# Altium schematic sheet Quail.SchDoc: Top Sheet
size Tabloid; DocumentNumber: 1; SheetNumber: 1; SheetTotal: 8; Project: Olympus
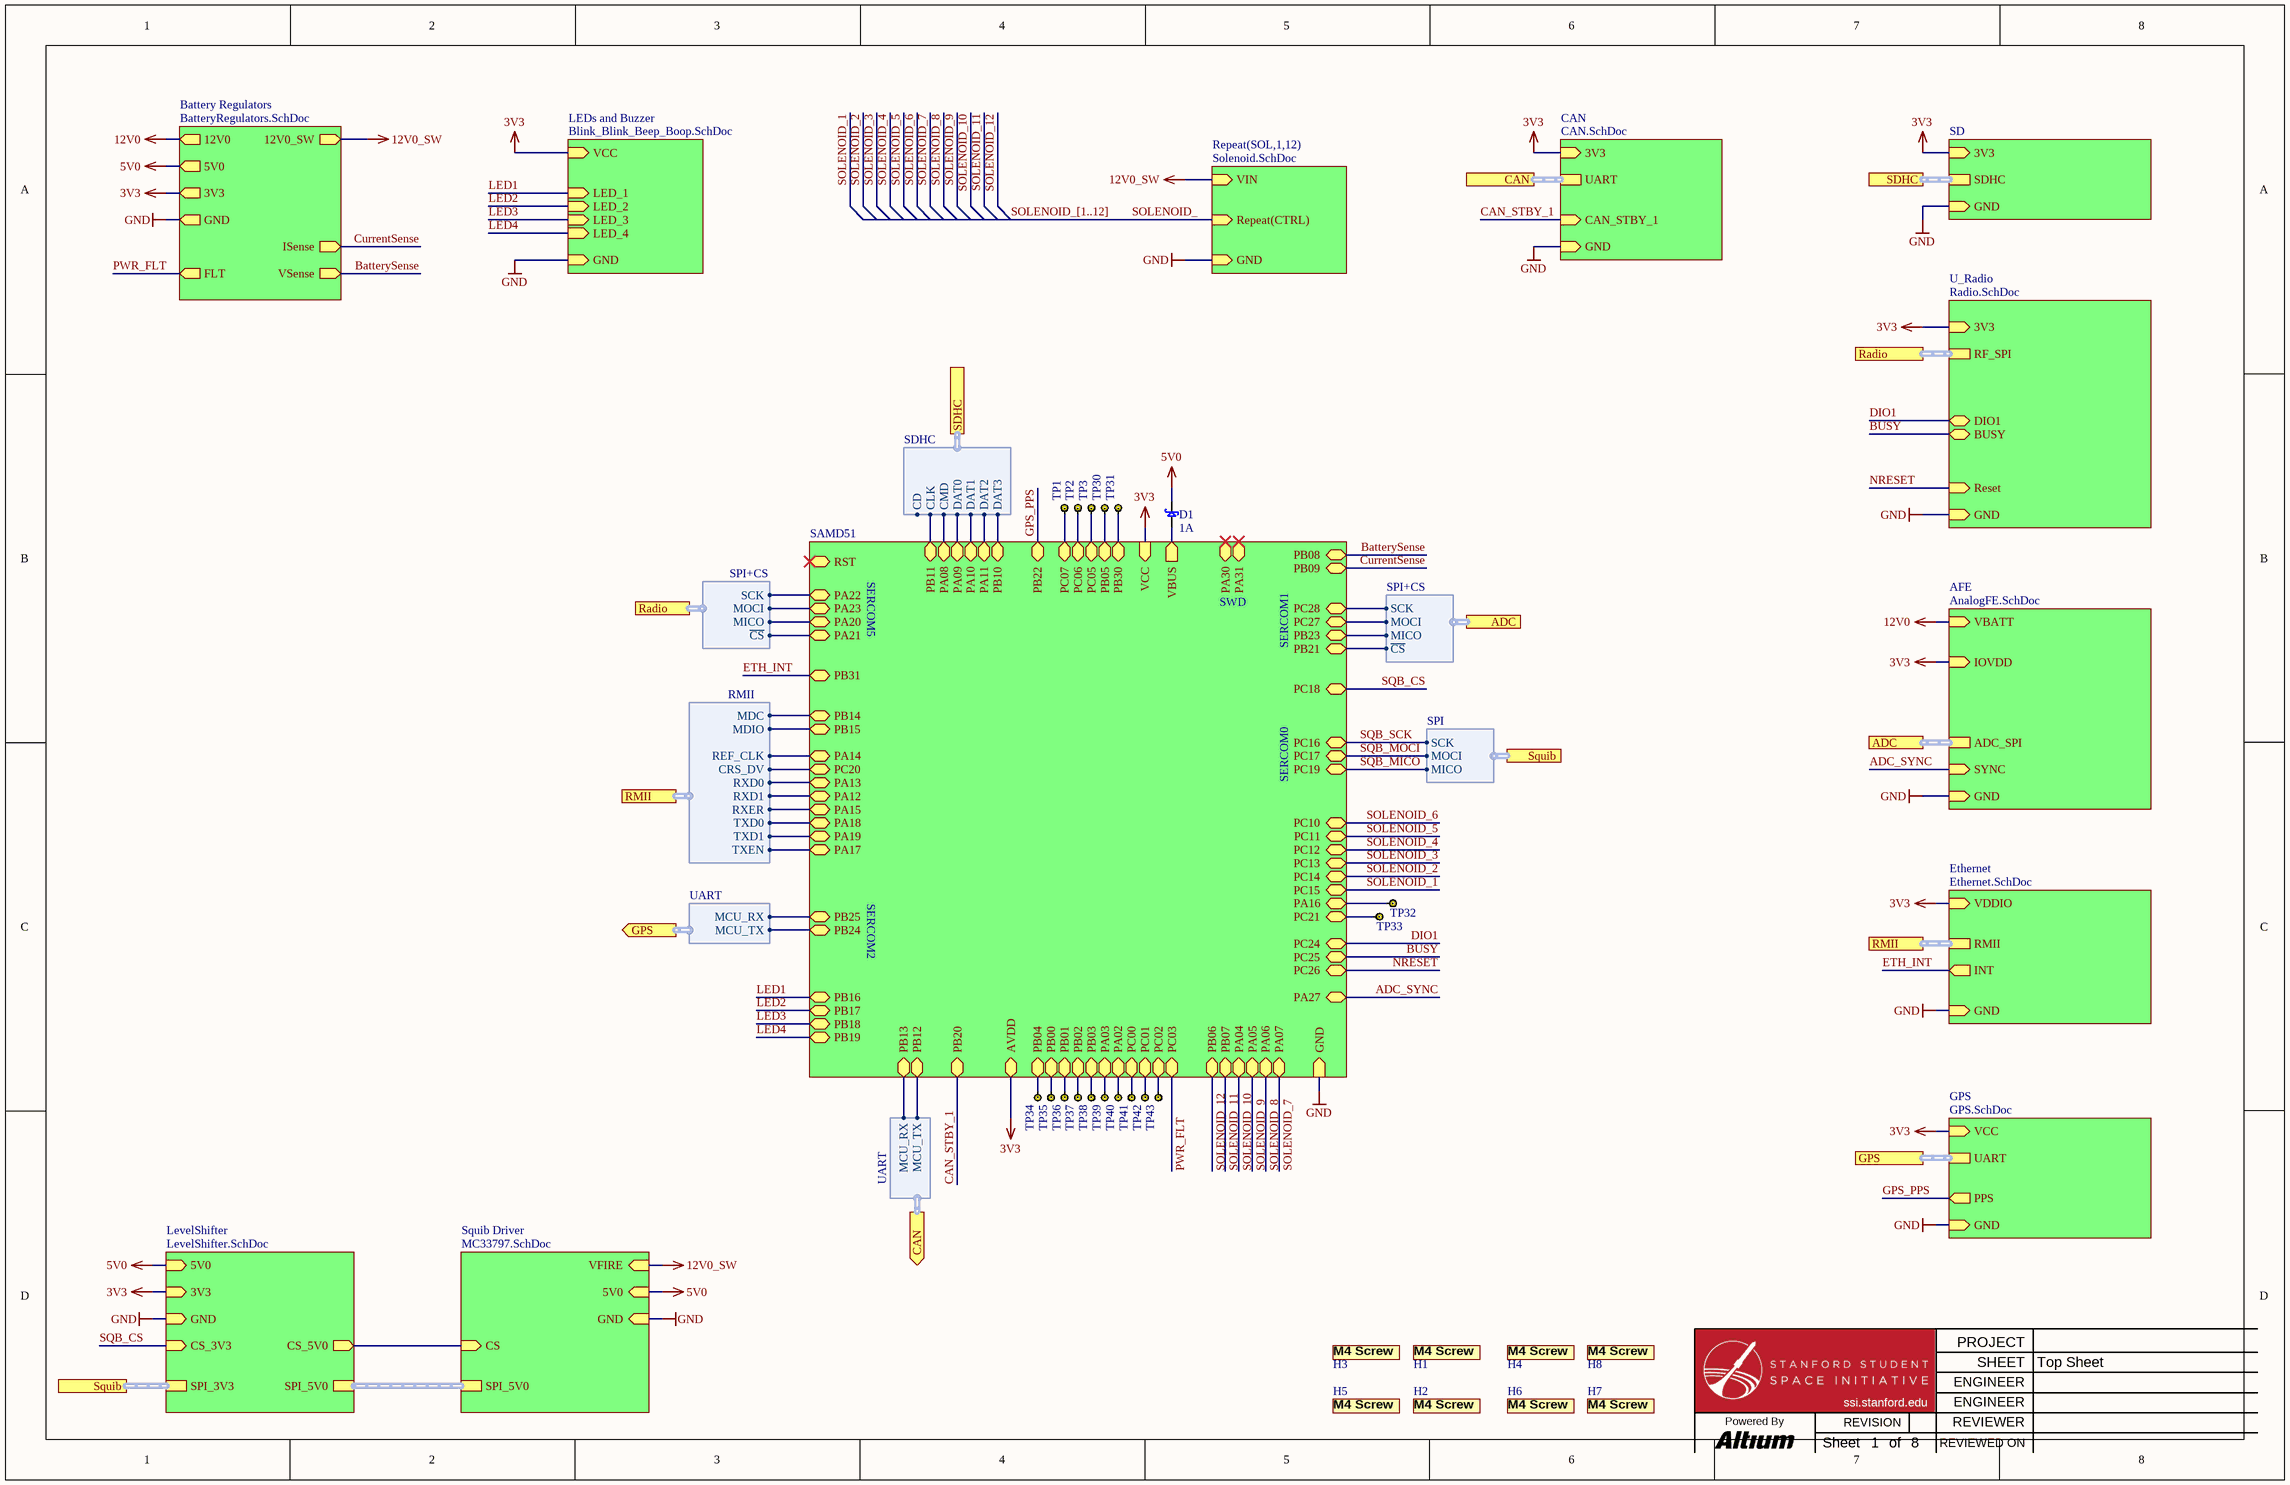
[diagram p0: Quail.SchDoc]

## Parts
D1  Current - Average Rectified (Io): 1A  [SMA]  (hidden comment: Diode_CD214A-B1100LF)
H1  SCREW_M4_PAN_PHILLIPS  [SCREW_M4]  (value not drawn)
H2  SCREW_M4_PAN_PHILLIPS  [SCREW_M4]  (value not drawn)
H3  SCREW_M4_PAN_PHILLIPS  [SCREW_M4]  (value not drawn)
H4  SCREW_M4_PAN_PHILLIPS  [SCREW_M4]  (value not drawn)
H5  SCREW_M4_PAN_PHILLIPS  [SCREW_M4]  (value not drawn)
H6  SCREW_M4_PAN_PHILLIPS  [SCREW_M4]  (value not drawn)
H7  SCREW_M4_PAN_PHILLIPS  [SCREW_M4]  (value not drawn)
H8  SCREW_M4_PAN_PHILLIPS  [SCREW_M4]  (value not drawn)
TP1  TEST_POINT_BLACK_KEYSTONE_5001  [TEST_POINT_BLACK_KEYSTONE_5001-Footprint-1]  (value not drawn)
TP2  TEST_POINT_BLACK_KEYSTONE_5001  [TEST_POINT_BLACK_KEYSTONE_5001-Footprint-1]  (value not drawn)
TP3  TEST_POINT_BLACK_KEYSTONE_5001  [TEST_POINT_BLACK_KEYSTONE_5001-Footprint-1]  (value not drawn)
TP30  TEST_POINT_BLACK_KEYSTONE_5001  [TEST_POINT_BLACK_KEYSTONE_5001-Footprint-1]  (value not drawn)
TP31  TEST_POINT_BLACK_KEYSTONE_5001  [TEST_POINT_BLACK_KEYSTONE_5001-Footprint-1]  (value not drawn)
TP32  TEST_POINT_BLACK_KEYSTONE_5001  [TEST_POINT_BLACK_KEYSTONE_5001-Footprint-1]  (value not drawn)
TP33  TEST_POINT_BLACK_KEYSTONE_5001  [TEST_POINT_BLACK_KEYSTONE_5001-Footprint-1]  (value not drawn)
TP34  TEST_POINT_BLACK_KEYSTONE_5001  [TEST_POINT_BLACK_KEYSTONE_5001-Footprint-1]  (value not drawn)
TP35  TEST_POINT_BLACK_KEYSTONE_5001  [TEST_POINT_BLACK_KEYSTONE_5001-Footprint-1]  (value not drawn)
TP36  TEST_POINT_BLACK_KEYSTONE_5001  [TEST_POINT_BLACK_KEYSTONE_5001-Footprint-1]  (value not drawn)
TP37  TEST_POINT_BLACK_KEYSTONE_5001  [TEST_POINT_BLACK_KEYSTONE_5001-Footprint-1]  (value not drawn)
TP38  TEST_POINT_BLACK_KEYSTONE_5001  [TEST_POINT_BLACK_KEYSTONE_5001-Footprint-1]  (value not drawn)
TP39  TEST_POINT_BLACK_KEYSTONE_5001  [TEST_POINT_BLACK_KEYSTONE_5001-Footprint-1]  (value not drawn)
TP40  TEST_POINT_BLACK_KEYSTONE_5001  [TEST_POINT_BLACK_KEYSTONE_5001-Footprint-1]  (value not drawn)
TP41  TEST_POINT_BLACK_KEYSTONE_5001  [TEST_POINT_BLACK_KEYSTONE_5001-Footprint-1]  (value not drawn)
TP42  TEST_POINT_BLACK_KEYSTONE_5001  [TEST_POINT_BLACK_KEYSTONE_5001-Footprint-1]  (value not drawn)
TP43  TEST_POINT_BLACK_KEYSTONE_5001  [TEST_POINT_BLACK_KEYSTONE_5001-Footprint-1]  (value not drawn)

## Sub-sheets
AFE = AnalogFE.SchDoc: VBATT (in), ADC_SPI (harness SPI+CS), GND (in), SYNC (in), IOVDD (in)
Battery Regulators = BatteryRegulators.SchDoc: 5V0 (out), 12V0 (out), 3V3 (out), GND (out), ISense (out), VSense (out), 12V0_SW (out), FLT (out)
CAN = CAN.SchDoc: 3V3 (in), GND (in), UART (harness UART), CAN_STBY_1 (in)
Ethernet = Ethernet.SchDoc: VDDIO (in), RMII (harness RMII), GND (in), INT (out)
GPS = GPS.SchDoc: VCC (in), GND (in), UART (harness UART), PPS (out)
LEDs and Buzzer = Blink_Blink_Beep_Boop.SchDoc: LED_4 (in), LED_2 (in), LED_1 (in), VCC (in), LED_3 (in), GND (in)
LevelShifter = LevelShifter.SchDoc: SPI_3V3 (harness SPI), SPI_5V0 (harness SPI), 3V3 (in), 5V0 (in), CS_5V0 (out), CS_3V3 (in), GND (in)
Repeat(SOL,1,12) = Solenoid.SchDoc: GND (in), VIN (in), Repeat(CTRL) (in)
SAMD51 = SAMD51.SchDoc: PA12 (bidir), PA13 (bidir), PA05 (bidir), PA07 (bidir), PA04 (bidir), PA06 (bidir), PB11 (bidir), PA08 (bidir), PA09 (bidir), PA10 (bidir), PA11 (bidir), PB10 (bidir), PB12 (bidir), PB13 (bidir), PA22 (bidir), PA23 (bidir), PA19 (bidir), PA17 (bidir), PA20 (bidir), PA21 (bidir), PB08 (bidir), PB07 (bidir), PB06 (bidir), PB09 (bidir), PB04 (bidir), PA03 (bidir), PA02 (bidir), PB05 (bidir), PB00 (bidir), PB30 (bidir), PA31 (bidir), PA30 (bidir), PB31 (bidir), PB16 (bidir), PA14 (bidir), PB17 (bidir), PB23 (bidir), PB22 (bidir), PA27 (bidir), PB02 (bidir), PB01 (bidir), PB03 (bidir), PA18 (bidir), GND (in), VCC (in), VBUS (out), PB14 (bidir), PB15 (bidir), PA15 (bidir), RST (bidir), PA16 (bidir), AVDD (bidir), PB21 (bidir), PC02 (bidir), PB20 (bidir), PB24 (bidir), PB18 (bidir), PB19 (bidir), PC10 (bidir), PC00 (bidir), PC07 (bidir), PC05 (bidir), PB25 (bidir), PC01 (bidir), PC06 (bidir), PC03 (bidir), PC14 (bidir), PC20 (bidir), PC15 (bidir), PC21 (bidir), PC26 (bidir), PC28 (bidir), PC25 (bidir), PC18 (bidir), PC19 (bidir), PC13 (bidir), PC24 (bidir), PC16 (bidir), PC12 (bidir), PC27 (bidir), PC17 (bidir), PC11 (bidir)
SD = SD.SchDoc: SDHC (harness SDHC), GND (in), 3V3 (in)
Squib Driver = MC33797.SchDoc: VFIRE (in), SPI_5V0 (harness SPI), CS (in), GND (in), 5V0 (in)
U_Radio = Radio.SchDoc: DIO1 (bidir), Reset (in), RF_SPI (harness SPI+CS), 3V3 (in), GND (in), BUSY (bidir)

## Ports
ADC (harness SPI+CS), CAN (harness UART), CAN (out, harness UART), GPS (harness UART), GPS (out, harness UART), Radio (harness SPI+CS), RMII (harness RMII), SDHC (harness SDHC), Squib (harness SPI)

## Harnesses
SDHC: CD, CLK, CMD, DAT0, DAT1, DAT2, DAT3
SPI+CS: SCK, MOCI, MICO, ~{CS}
SPI: SCK, MOCI, MICO
RMII: MDC, MDIO, REF_CLK, CRS_DV, RXD0, RXD1, RXER, TXD0, TXD1, TXEN
UART: MCU_RX, MCU_TX

## Nets
3V3: sheet Battery Regulators/3V3, sheet LevelShifter/3V3, sheet LEDs and Buzzer/VCC, sheet SAMD51/VCC, sheet SAMD51/AVDD, sheet SD/3V3, sheet U_Radio/3V3, sheet AFE/IOVDD, sheet Ethernet/VDDIO, sheet GPS/VCC, sheet CAN/3V3
5V0: D1.2(Cathode) ; sheet Battery Regulators/5V0, sheet Squib Driver/5V0, sheet LevelShifter/5V0
12V0: sheet Battery Regulators/12V0, sheet AFE/VBATT
12V0_SW: sheet Battery Regulators/12V0_SW, sheet Squib Driver/VFIRE, sheet Repeat(SOL,1,12)/VIN
GND: sheet Battery Regulators/GND, sheet Squib Driver/GND, sheet LevelShifter/GND, sheet LEDs and Buzzer/GND, sheet SAMD51/GND, sheet SD/GND, sheet U_Radio/GND, sheet AFE/GND, sheet Ethernet/GND, sheet GPS/GND, sheet CAN/GND, sheet Repeat(SOL,1,12)/GND
ADC_SYNC: sheet SAMD51/PA27, sheet AFE/SYNC
BatterySense: sheet Battery Regulators/VSense, sheet SAMD51/PB08
BUSY: sheet SAMD51/PC25, sheet U_Radio/BUSY
CAN_STBY_1: sheet SAMD51/PB20, sheet CAN/CAN_STBY_1
CurrentSense: sheet Battery Regulators/ISense, sheet SAMD51/PB09
DIO1: sheet SAMD51/PC24, sheet U_Radio/DIO1
ETH_INT: sheet SAMD51/PB31, sheet Ethernet/INT
GPS_PPS: sheet SAMD51/PB22, sheet GPS/PPS
LED1: sheet LEDs and Buzzer/LED_1, sheet SAMD51/PB16
LED2: sheet LEDs and Buzzer/LED_2, sheet SAMD51/PB17
LED3: sheet LEDs and Buzzer/LED_3, sheet SAMD51/PB18
LED4: sheet LEDs and Buzzer/LED_4, sheet SAMD51/PB19
NRESET: sheet SAMD51/PC26, sheet U_Radio/Reset
PWR_FLT: sheet Battery Regulators/FLT, sheet SAMD51/PC03
SOLENOID_: sheet Repeat(SOL,1,12)/Repeat(CTRL)
SOLENOID_1: sheet SAMD51/PC15
SOLENOID_2: sheet SAMD51/PC14
SOLENOID_3: sheet SAMD51/PC13
SOLENOID_4: sheet SAMD51/PC12
SOLENOID_5: sheet SAMD51/PC11
SOLENOID_6: sheet SAMD51/PC10
SOLENOID_7: sheet SAMD51/PA07
SOLENOID_8: sheet SAMD51/PA06
SOLENOID_9: sheet SAMD51/PA05
SOLENOID_10: sheet SAMD51/PA04
SOLENOID_11: sheet SAMD51/PB07
SOLENOID_12: sheet SAMD51/PB06
SQB_CS: sheet LevelShifter/CS_3V3, sheet SAMD51/PC18
SQB_MICO: sheet SAMD51/PC19, port Squib.MICO
SQB_MOCI: sheet SAMD51/PC17, port Squib.MOCI
SQB_SCK: sheet SAMD51/PC16, port Squib.SCK
NetD1_1: D1.1(Anode) ; sheet SAMD51/VBUS
NetTP1_1: TP1.1 ; sheet SAMD51/PC07
NetTP2_1: TP2.1 ; sheet SAMD51/PC06
NetTP3_1: TP3.1 ; sheet SAMD51/PC05
NetTP30_1: TP30.1 ; sheet SAMD51/PB05
NetTP31_1: TP31.1 ; sheet SAMD51/PB30
NetTP32_1: TP32.1 ; sheet SAMD51/PA16
NetTP33_1: TP33.1 ; sheet SAMD51/PC21
NetTP34_1: TP34.1 ; sheet SAMD51/PB04
NetTP35_1: TP35.1 ; sheet SAMD51/PB00
NetTP36_1: TP36.1 ; sheet SAMD51/PB01
NetTP37_1: TP37.1 ; sheet SAMD51/PB02
NetTP38_1: TP38.1 ; sheet SAMD51/PB03
NetTP39_1: TP39.1 ; sheet SAMD51/PA03
NetTP40_1: TP40.1 ; sheet SAMD51/PA02
NetTP41_1: TP41.1 ; sheet SAMD51/PC00
NetTP42_1: TP42.1 ; sheet SAMD51/PC01
NetTP43_1: TP43.1 ; sheet SAMD51/PC02
(unnamed): sheet Squib Driver/CS, sheet LevelShifter/CS_5V0
(unnamed): sheet SAMD51/PA12, port RMII.RXD1
(unnamed): sheet SAMD51/PA13, port RMII.RXD0
(unnamed): sheet SAMD51/PB11, port SDHC.CLK
(unnamed): sheet SAMD51/PA08, port SDHC.CMD
(unnamed): sheet SAMD51/PA09, port SDHC.DAT0
(unnamed): sheet SAMD51/PA10, port SDHC.DAT1
(unnamed): sheet SAMD51/PA11, port SDHC.DAT2
(unnamed): sheet SAMD51/PB10, port SDHC.DAT3
(unnamed): sheet SAMD51/PB12, port CAN.MCU_TX
(unnamed): sheet SAMD51/PB13, port CAN.MCU_RX
(unnamed): sheet SAMD51/PA22, port Radio.SCK
(unnamed): sheet SAMD51/PA23, port Radio.MOCI
(unnamed): sheet SAMD51/PA19, port RMII.TXD1
(unnamed): sheet SAMD51/PA17, port RMII.TXEN
(unnamed): sheet SAMD51/PA20, port Radio.MICO
(unnamed): sheet SAMD51/PA21, port Radio.~{CS}
(unnamed): sheet SAMD51/PA14, port RMII.REF_CLK
(unnamed): sheet SAMD51/PB23, port ADC.MICO
(unnamed): sheet SAMD51/PA18, port RMII.TXD0
(unnamed): sheet SAMD51/PB14, port RMII.MDC
(unnamed): sheet SAMD51/PB15, port RMII.MDIO
(unnamed): sheet SAMD51/PA15, port RMII.RXER
(unnamed): sheet SAMD51/PB21, port ADC.~{CS}
(unnamed): sheet SAMD51/PB24, port GPS.MCU_TX
(unnamed): sheet SAMD51/PB25, port GPS.MCU_RX
(unnamed): sheet SAMD51/PC20, port RMII.CRS_DV
(unnamed): sheet SAMD51/PC28, port ADC.SCK
(unnamed): sheet SAMD51/PC27, port ADC.MOCI

## Buses and harness runs
bus SOLENOID_[1..12]
harness port ADC = sheet AFE/ADC_SPI
harness port CAN = sheet CAN/UART
harness port GPS = sheet GPS/UART
harness port Radio = sheet U_Radio/RF_SPI
harness port RMII = sheet Ethernet/RMII
harness port SDHC = sheet SD/SDHC
harness port Squib = sheet LevelShifter/SPI_3V3
harness sheet LevelShifter/SPI_5V0 = sheet Squib Driver/SPI_5V0

## Notes on the sheet
- SERCOM5
- SWD
- SERCOM1
- SERCOM0
- SERCOM2
- PROJECT
- SHEET
- Powered By
- Sheet
- of
- REVISION
- ssi.stanford.edu
- ENGINEER
- REVIEWER
- REVIEWED ON
- (in symbol CMP-054-0009-1) M4 Screw

## Library data of the parts
D1 = CMP-033-0060-1: Diode Schottky 100V 1A Surface Mount SMA (DO-214AC); Manufacturer: Bourns Inc.; Voltage - Forward (Vf) (Max) @ If: 790mV @ 1A; Current - Reverse Leakage @ Vr: 500µA @ 100V; Speed: Fast Recovery =< 500ns, > 200mA (Io); Capacitance @ Vr, F: 30pF @ 4V, 1MHz; Design Item ID: Diode_CD214A-B1100LF; Part Status: Active; Source: diode.SchLib; Stock 1: 21982; Manufacturer Part Number: CD214A-B1100LF; Diode Type: Schottky; Voltage - DC Reverse (Vr) (Max): 100V; Reverse Recovery Time (trr): -; Operating Temperature - Junction: -55°C ~ 125°C; RoHS: RoHS Compliant; Supplier Device Package: SMA (DO-214AC); Package / Case: DO-214AC, SMA; Packaging: Cut Tape (CT); ComponentLink1Description: http://www.bourns.com/docs/Product-Datasheets/CD214-B120_B1100.pdf; Mounting Type: Surface Mount; Pricing 1: 1=0.54, 10=0.42, 25=0.3544, 100=0.2888, 250=0.2392, 500=0.1976, 1000=0.148, 2500=0.136 (USD); ComponentLink1URL: http://www.bourns.com/docs/Product-Datasheets/CD214-B120_B1100.pdf
H1-H8 = CMP-054-0009-1: MACHINE SCREW PAN PHILLIPS M4; Manufacturer: B&F Fastener Supply; Manufacturer Part Number: MPMS 004 0008 PH; Head Diameter: 0.308" (7.82mm); Screw Head Type: Pan Head; Head Height: 0.120" (3.05mm); Plating: Zinc; Length - Below Head: 0.315" (8.00mm); Features: -; Length - Overall: 0.435" (11.05mm); ComponentLink1Description: Datasheet; Source: mechanical.SchLib; ComponentLink1URL: http://www.fasnetdirect.com/refguide/MetD7985a.pdf; Drive Type: Phillips; Material: -; Thread Size: M4; Pricing 1: 100=0.0756, 1000=0.06048 (USD); Design Item ID: SCREW_M4_PAN_PHILLIPS; RoHS: RoHS non-compliant; Stock 1: 2800
TP1-TP3 TP30-TP43 = CMP-055-0004-2: BLACK T/H TEST POINT; Manufacturer Part Number: 5001; Manufacturer: Keystone Electronics; Material - Body: Phosphor Bronze; Plating: Silver; Material - Insulation: Nylon 46, UL 94V-0; Design Item ID: TEST_POINT_BLACK_KEYSTONE_5001; Color: Black; Packaging: Bulk; Stock 1: 718799; Pricing 1: 1=0.37, 10=0.316, 50=0.2298, 100=0.2209, 250=0.19832, 500=0.18932, 1000=0.1616, 2500=0.14424, 5000=0.13523 (USD); ComponentLink1URL: http://www.keyelco.com/product-pdf.cfm?p=1310; RoHS: RoHS Compliant; Part Status: Active; Size / Dimension: 0.100" Dia x 0.180" L (2.54mm x 4.57mm); Source: mechanical.SchLib; ComponentLink1Description: http://www.keyelco.com/product-pdf.cfm?p=1310; Mounting Type: 0.040" (1.02mm) Hole Diameter